# EasyEDA Pro project ProPrj_measure_boardd_2025-03-12.epro

# Schematic Schematic1
Board Name: Board1; Create Date: 2025-02-12; Page Name: P1; Project Name: measure_boardd; Schematic Name: Schematic1; Update Date: 2025-03-10; Company: EasyEDA.com; Page Size: A4; Version: V1.0
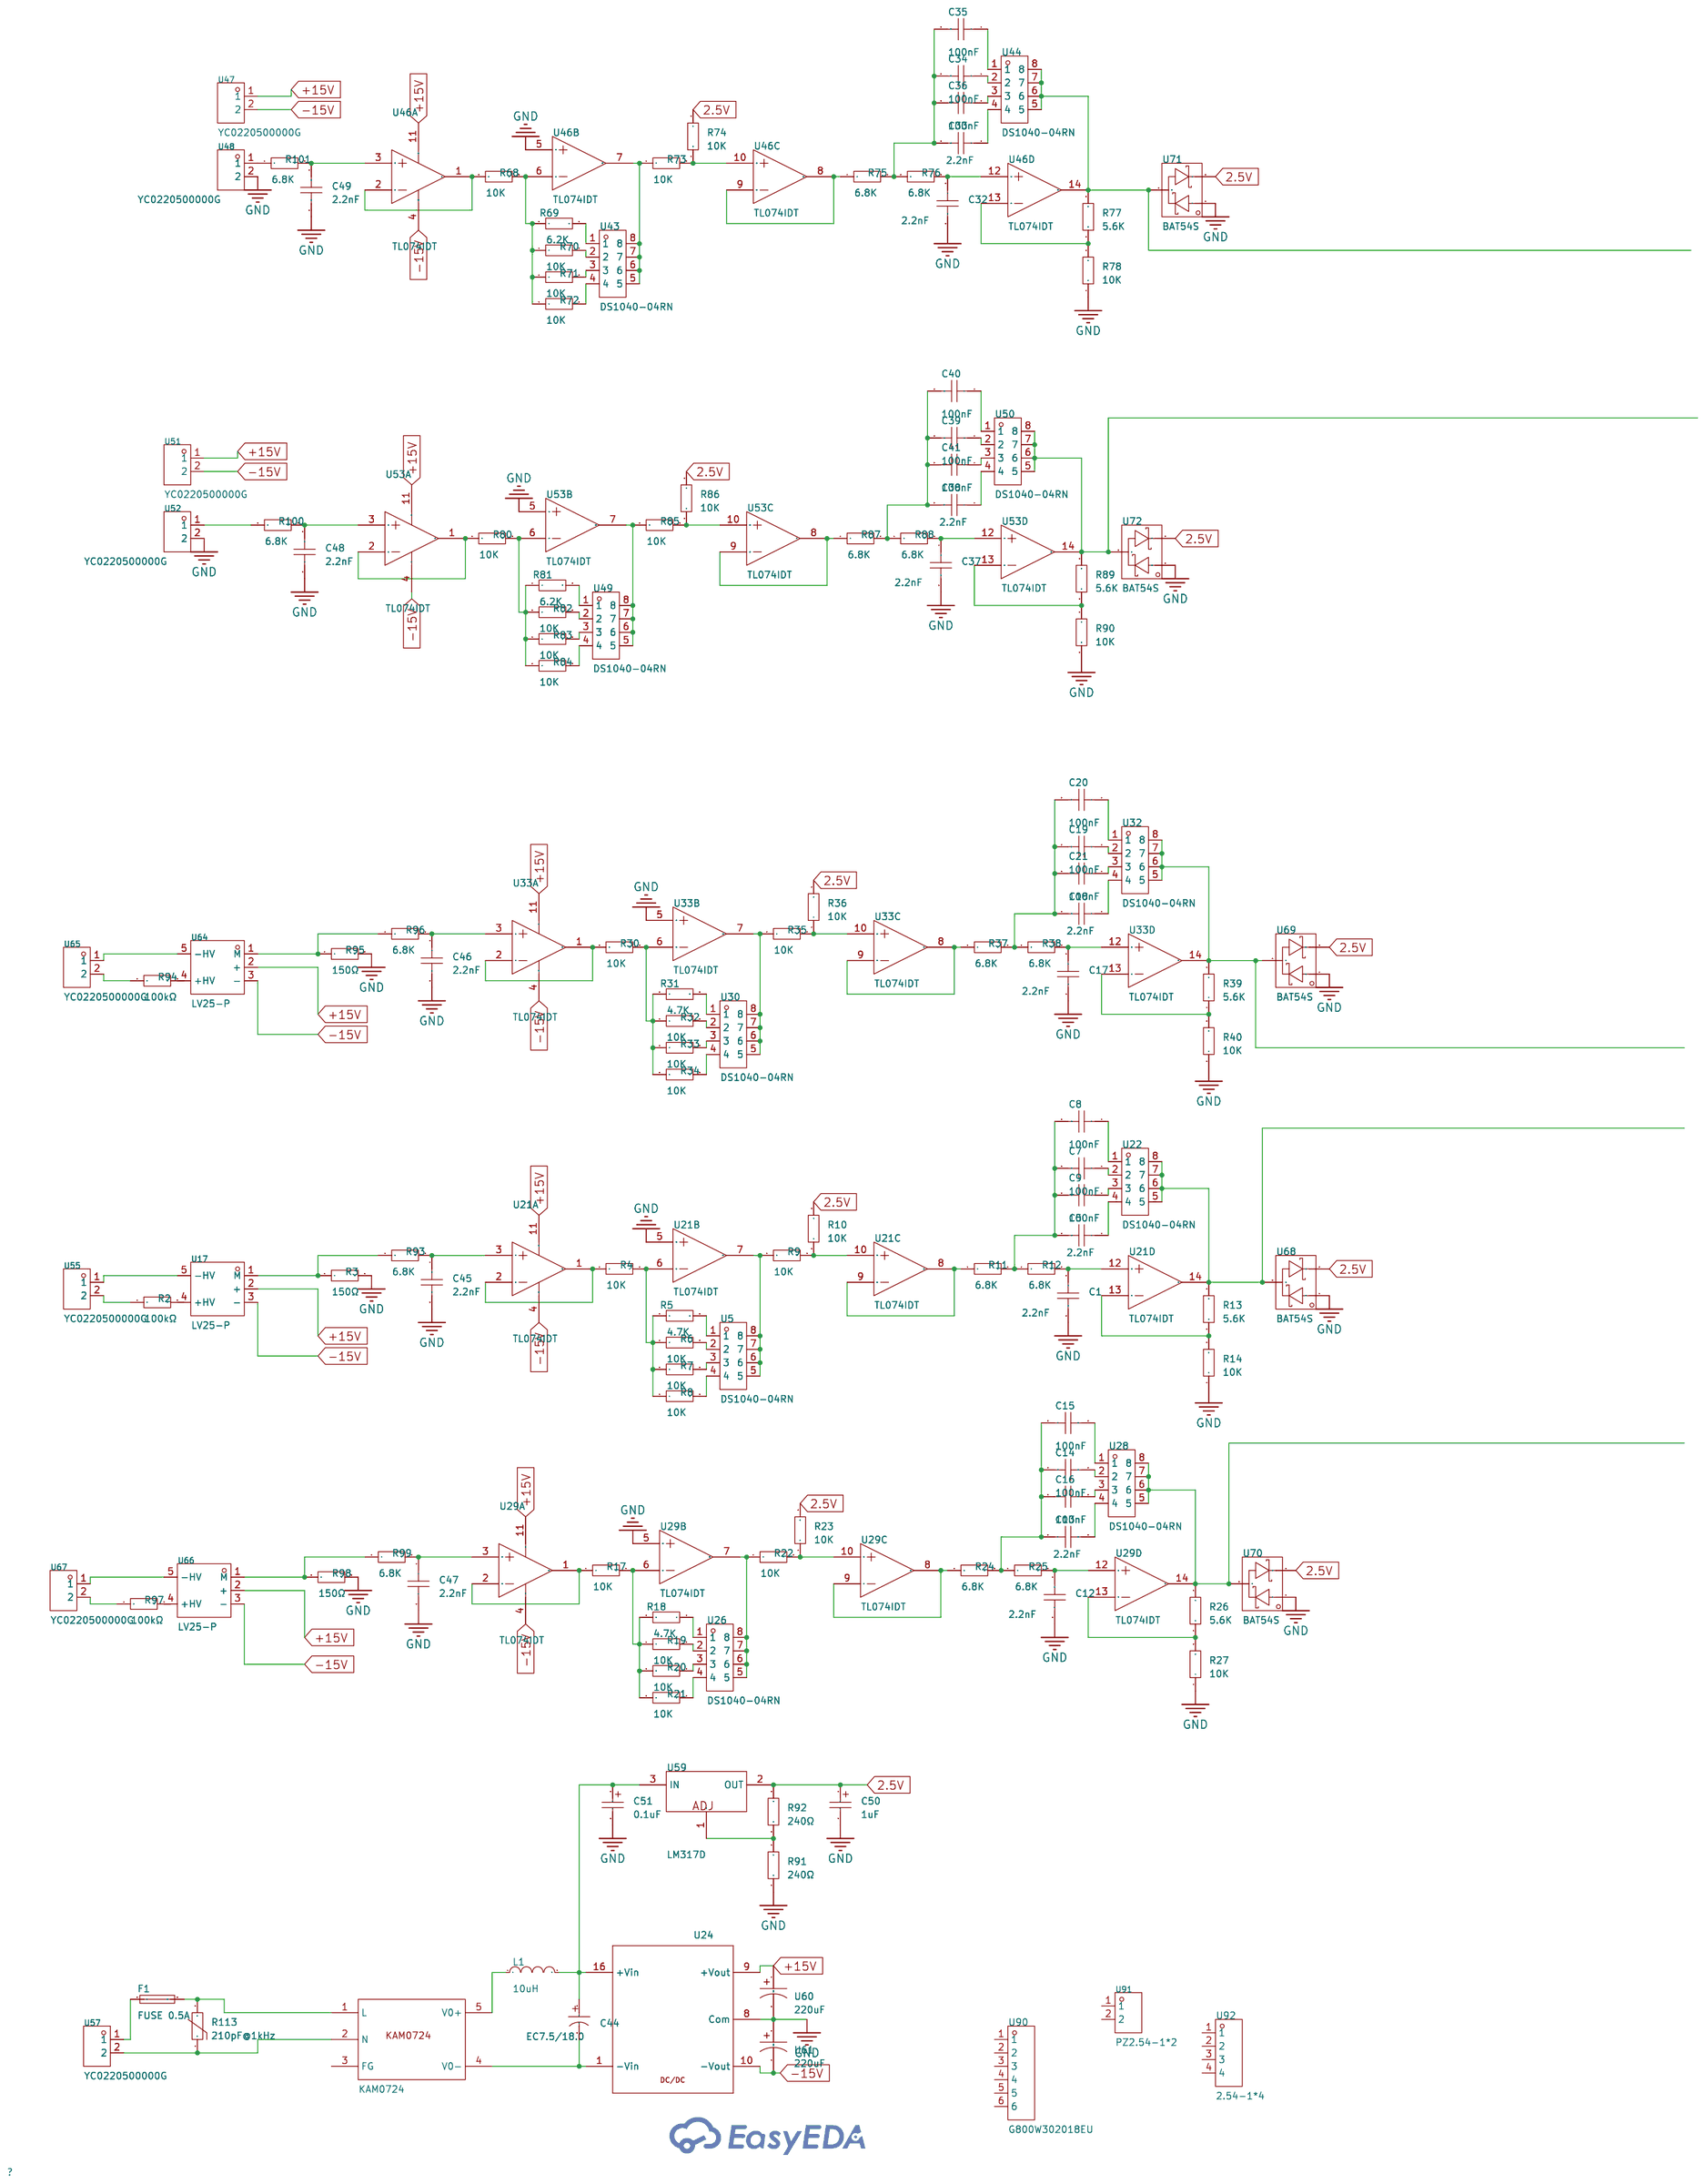
[diagram p0: schematic sheet]

## Parts
C1  2.2nF  [C0805]
C5  2.2nF  [C0805]
C7  100nF  [C0805]
C8  100nF  [C0805]
C9  100nF  [C0805]
C12  2.2nF  [C0805]
C13  2.2nF  [C0805]
C14  100nF  [C0805]
C15  100nF  [C0805]
C16  100nF  [C0805]
C17  2.2nF  [C0805]
C18  2.2nF  [C0805]
C19  100nF  [C0805]
C20  100nF  [C0805]
C21  100nF  [C0805]
C32  2.2nF  [C0805]
C33  2.2nF  [C0805]
C34  100nF  [C0805]
C35  100nF  [C0805]
C36  100nF  [C0805]
C37  2.2nF  [C0805]
C38  2.2nF  [C0805]
C39  100nF  [C0805]
C40  100nF  [C0805]
C41  100nF  [C0805]
C44  EC7.5/18.0  [CAP-TH_BD18.0-P7.50-D1.2-FD]
C45  2.2nF  [C0805]
C46  2.2nF  [C0805]
C47  2.2nF  [C0805]
C48  2.2nF  [C0805]
C49  2.2nF  [C0805]
C50  1uF  [CAP-SMD_BD4.0-L4.3-W4.3-FD]
C51  0.1uF  [CAP-SMD_BD4.0-L4.3-W4.3-FD]
F1  FUSE 0.5A  [FUSE-TH_L8.5-W4.0-P5.08-D0.6]
L1  10uH  [L0805]
R2  100kΩ  [RES-TH_BD8.0-L24.5-P28.50-D0.8]
R3  150Ω  [R_AXIAL-0.4]
R4  10K  [R0603]
R5  4.7K  [R0603]
R6  10K  [R0603]
R7  10K  [R0603]
R8  10K  [R0603]
R9  10K  [R0603]
R10  10K  [R0603]
R11  6.8K  [R0603]
R12  6.8K  [R0603]
R13  5.6K  [R0603]
R14  10K  [R0603]
R17  10K  [R0603]
R18  4.7K  [R0603]
R19  10K  [R0603]
R20  10K  [R0603]
R21  10K  [R0603]
R22  10K  [R0603]
R23  10K  [R0603]
R24  6.8K  [R0603]
R25  6.8K  [R0603]
R26  5.6K  [R0603]
R27  10K  [R0603]
R30  10K  [R0603]
R31  4.7K  [R0603]
R32  10K  [R0603]
R33  10K  [R0603]
R34  10K  [R0603]
R35  10K  [R0603]
R36  10K  [R0603]
R37  6.8K  [R0603]
R38  6.8K  [R0603]
R39  5.6K  [R0603]
R40  10K  [R0603]
R68  10K  [R0603]
R69  6.2K  [R0603]
R70  10K  [R0603]
R71  10K  [R0603]
R72  10K  [R0603]
R73  10K  [R0603]
R74  10K  [R0603]
R75  6.8K  [R0603]
R76  6.8K  [R0603]
R77  5.6K  [R0603]
R78  10K  [R0603]
R80  10K  [R0603]
R81  6.2K  [R0603]
R82  10K  [R0603]
R83  10K  [R0603]
R84  10K  [R0603]
R85  10K  [R0603]
R86  10K  [R0603]
R87  6.8K  [R0603]
R88  6.8K  [R0603]
R89  5.6K  [R0603]
R90  10K  [R0603]
R91  240Ω  [R1210]
R92  240Ω  [R1210]
R93  6.8K  [R0603]
R94  100kΩ  [RES-TH_BD8.0-L24.5-P28.50-D0.8]
R95  150Ω  [R_AXIAL-0.4]
R96  6.8K  [R0603]
R97  100kΩ  [RES-TH_BD8.0-L24.5-P28.50-D0.8]
R98  150Ω  [R_AXIAL-0.4]
R99  6.8K  [R0603]
R100  6.8K  [R0603]
R101  6.8K  [R0603]
R113  210pF@1kHz  [RES-TH_L12.5-W5.1-P7.50-D1.2-S2.20]
U5  DS1040-04RN  [KEY-TH_DS1040-04RN]
U17  LV25-P  [SENSOR-TH_LV25-P]
U21  TL074IDT  [SOIC-14_L8.7-W3.9-P1.27-LS6.0-BL]  (sections 1,2,3,4)
U22  DS1040-04RN  [KEY-TH_DS1040-04RN]
U24  -  [TEL_8_SERIES]
U26  DS1040-04RN  [KEY-TH_DS1040-04RN]
U28  DS1040-04RN  [KEY-TH_DS1040-04RN]
U29  TL074IDT  [SOIC-14_L8.7-W3.9-P1.27-LS6.0-BL]  (sections 1,2,3,4)
U30  DS1040-04RN  [KEY-TH_DS1040-04RN]
U32  DS1040-04RN  [KEY-TH_DS1040-04RN]
U33  TL074IDT  [SOIC-14_L8.7-W3.9-P1.27-LS6.0-BL]  (sections 1,2,3,4)
U43  DS1040-04RN  [KEY-TH_DS1040-04RN]
U44  DS1040-04RN  [KEY-TH_DS1040-04RN]
U46  TL074IDT  [SOIC-14_L8.7-W3.9-P1.27-LS6.0-BL]  (sections 1,2,3,4)
U47  YC0220500000G  [CONN-TH_YC0220500000G]
U48  YC0220500000G  [CONN-TH_YC0220500000G]
U49  DS1040-04RN  [KEY-TH_DS1040-04RN]
U50  DS1040-04RN  [KEY-TH_DS1040-04RN]
U51  YC0220500000G  [CONN-TH_YC0220500000G]
U52  YC0220500000G  [CONN-TH_YC0220500000G]
U53  TL074IDT  [SOIC-14_L8.7-W3.9-P1.27-LS6.0-BL]  (sections 1,2,3,4)
U55  YC0220500000G  [CONN-TH_YC0220500000G]
U57  YC0220500000G  [CONN-TH_YC0220500000G]
U59  LM317D  [TO-252-2_L6.6-W6.1-P4.57-LS9.9-BR-CW]
U60  220uF  [CAP-TH_BD6.3-P2.50-D0.6-FD]
U61  220uF  [CAP-TH_BD6.3-P2.50-D0.6-FD]
U62  KAM0724  [KAM0724]
U64  LV25-P  [SENSOR-TH_LV25-P]
U65  YC0220500000G  [CONN-TH_YC0220500000G]
U66  LV25-P  [SENSOR-TH_LV25-P]
U67  YC0220500000G  [CONN-TH_YC0220500000G]
U68  BAT54S  [SOT-23-3_L2.9-W1.3-P1.90-LS2.4-BR]
U69  BAT54S  [SOT-23-3_L2.9-W1.3-P1.90-LS2.4-BR]
U70  BAT54S  [SOT-23-3_L2.9-W1.3-P1.90-LS2.4-BR]
U71  BAT54S  [SOT-23-3_L2.9-W1.3-P1.90-LS2.4-BR]
U72  BAT54S  [SOT-23-3_L2.9-W1.3-P1.90-LS2.4-BR]
U90  G800W302018EU  [HDR-TH_6P-P2.54-V-M]
U91  PZ2.54-1*2  [HDR-TH_2P-P2.54-V-M-3]
U92  2.54-1*4  [HDR-TH_4P-P2.54-V-M-1]

## Library data of the parts
C1 C5 C7-C9 C12-C21 C32-C41 C45-C49 = CAP_0805: Supplier Footprint: 0805
C44 = EC7.5/18.0: Supplier Part: C9900017020; Supplier Footprint: 1000uF/63V；间距7.5mm外径18mm; JLCPCB Part Class: Extended Part; Supplier: LCSC
C50 C51 = C_Ele_SMD_4x5.5mm: Supplier Footprint: SMD,4x5.5mm
F1 = FUSE 0.5A: Supplier: LCSC; Supplier Part: C312031; Manufacturer: TLC(竞沃); Manufacturer Part: SQT3.15M; JLCPCB Part Class: Extended Part
L1 = L_0805
R2 R94 R97 = Res_AXIAL-5W: Supplier Footprint: Through
R3 R95 R98 = Res_AXIAL-1/4W: Supplier Footprint: Through
R4-R14 R17-R27 R30-R40 R68-R78 R80-R90 R93 R96 R99-R101 = Res_0603: Supplier Footprint: 0603
R91 R92 = Res_1210: Supplier Footprint: 1210
R113 = VDR-10D471K: Varistor Voltage:423V~517V Varistor Voltage:423V~517V Clamping Voltage: Maximum DC Volts: Maximum AC Volts: Peak Current: Energy:67J Energy:67J Capacitance:210pF@1kHz; LCSC Part Name: 钳位电压775V 67焦耳 插件压敏电阻; Supplier Part: C316609; Manufacturer: VDR(嵩隆); Supplier Footprint: 插件; JLCPCB Part Class: Extended Part; Datasheet: https://atta.szlcsc.com/upload/public/pdf/source/20210908/63B170955D01000DCFD7BF012F3B4797.pdf; Supplier: LCSC; Varistor Voltage: 423V~517V; Energy: 67J
U5 U22 U26 U28 U30 U32 U43 U44 U49 U50 = DS1040-04RN: Number of Positions:4Bit Lead Pitch:2.54mm Color:Red; Supplier Part: C3024970; Manufacturer: CONNFLY; Supplier Footprint: 插件; JLCPCB Part Class: Extended Part; Datasheet: https://atta.szlcsc.com/upload/public/pdf/source/20220524/E487E22DEF95345BB2C3C9897C5E0C2D.pdf; Supplier: LCSC; Number of Positions: 4Bit; Lead Pitch: 2.54mm; Color: Red
U17 U64 U66 = LV25-P: Supplier Part: C453476; Manufacturer: LEM(莱姆); Supplier Footprint: 插件; JLCPCB Part Class: Extended Part; Datasheet: https://atta.szlcsc.com/upload/public/pdf/source/20200901/C453476_5BA3BC4F59636857A644FEC5A2FF2FFA.pdf; Supplier: LCSC
U21 U29 U33 U46 U53 = TL074IDT: Number of Circuits:Quad Gain Bandwidth Product(GBP):3MHz Current - Input Bias(Ib):20pA Voltage - Input Offset(Vos):3mV Slew Rate(SR):13V/us Supply Current Per Channel:1.4mA Operating Temperature:-40℃~+105℃ Operating Temperature:-40℃~+105℃; Supplier Part: C107644; Manufacturer: ST(意法半导体); Supplier Footprint: SOIC-14; JLCPCB Part Class: Extended Part; Datasheet: https://atta.szlcsc.com/upload/public/pdf/source/20180511/C79668_B9AF02D8BC6CC04960E26C1CA949D7C5.pdf; Supplier: LCSC; Number of Circuits: Quad; Gain Bandwidth Product(GBP): 3MHz; Current - Input Bias(Ib): 20pA; Voltage - Input Offset(Vos): 3mV; Slew Rate(SR): 13V/us; Supply Current Per Channel: 1.4mA; Operating Temperature: -40℃~+105℃
U24 = TEL_8-2423
U47 U48 U51 U52 U55 U57 U65 U67 = YC0220500000G: Structure:1x2P Pitch:5.08mm Color:Green Mounting Style:Straight Current Rating (Max):10A Voltage Rating (Max):300V Number of Pins:2P Number of Rows:1 Wire Gauge - AWG:16~26 Wire Gauge - AWG:16~26 Number of PINs Per Row:2 Operating Temperature Range:-40℃~+; LCSC Part Name: 5.08mm 1x2P 排数:1 每排P数:2 直插; Supplier Part: C2683165; Manufacturer: Amphenol; Supplier Footprint: 插件,P=5.08mm; JLCPCB Part Class: Extended Part; Datasheet: https://atta.szlcsc.com/upload/public/pdf/source/20210329/C2683165_184F37C3428385EA6CBC65FCC2B0FE9A.pdf; Supplier: LCSC; Structure: 1x2P; Pitch: 5.08mm; Color: Green; Mounting Style: Straight; Current Rating (Max): 10A; Voltage Rating (Max): 300V; Number of Pins: 2P; Number of Rows: 1; Wire Gauge - AWG: 16~26; Number of PINs Per Row: 2; Operating Temperature Range: -40℃~+115℃
U59 = LM317D: Output Type:Adjustable Maximum Input Voltage:- Output Voltage:1.2V~37V Output Voltage:1.2V~37V Output Current:1.5A Power Supply Rejection Ratio (PSRR):80dB@(120Hz) Operating Temperature:0℃~+125℃@(Tj) Operating Temperature:0℃~+125℃@(Tj) Output Polarity:Pos; Supplier Part: C19273122; Manufacturer: YFW(佑风微); Supplier Footprint: TO-252; JLCPCB Part Class: Extended Part; Datasheet: https://atta.szlcsc.com/upload/public/pdf/source/20231201/418A6F2C5017D5AE5FD34272C42A6510.pdf; Supplier: LCSC; Output Type: Adjustable; Output Voltage: 1.2V~37V; Output Current: 1.5A; Power Supply Rejection Ratio (PSRR): 80dB@(120Hz); Operating Temperature: 0℃~+125℃@(Tj); Output Polarity: Positive electrode; Number of Outputs: 1
U60 U61 = 25V220uF CD288: Capacitance: Tolerance:±20% Tolerance:±20% Rated Voltage: Lead Spacing: φD: L: Operating Temperature:-40℃~+105℃ Operating Temperature:-40℃~+105℃; LCSC Part Name: 220uF ±20% 25V; Supplier Part: C2960221; Manufacturer: HRK(鸿瑞凯电子); Supplier Footprint: 插件,D6.3xL12mm; JLCPCB Part Class: Extended Part; Datasheet: https://atta.szlcsc.com/upload/public/pdf/source/20220224/4E62C25599E7046827B6B2B120EB46F9.pdf; Supplier: LCSC; Tolerance: ±20%; Operating Temperature: -40℃~+105℃
U62 = KAM0724
U68-U72 = BAT54S_C22374724: Supplier Part: C22374724; Manufacturer: DOWO(东沃); Supplier Footprint: SOT-23; JLCPCB Part Class: Extended Part; Datasheet: https://atta.szlcsc.com/upload/public/pdf/source/20240402/00E7935314739AA8A2B57AD1567A1D2C.pdf; Supplier: LCSC
U90 = G800W302018EU: Pin Structure:1x6P Pitch:2.54mm Number of Rows:Single Row Number of Pins:6P; LCSC Part Name: 1x6P 间距:2.54mm; Supplier Part: C5427040; Manufacturer: Amphenol; Supplier Footprint: 插件,P=2.54mm; JLCPCB Part Class: Extended Part; Supplier: LCSC; Pin Structure: 1x6P; Pitch: 2.54mm; Number of Rows: Single Row; Number of Pins: 6P
U91 = PZ2.54-1*2: Supplier Part: C5360898; Manufacturer: ZHOURI(洲日); Supplier Footprint: 插件,P=2.54mm; JLCPCB Part Class: Extended Part; Datasheet: https://atta.szlcsc.com/upload/public/pdf/source/20220323/224B1BE3995440B78463F26874D564A6.pdf; Supplier: LCSC
U92 = 2.54-1*4: Pin Structure:1x4P Pitch:2.54mm Number of Rows:Plugin Number of Pins:4P; Supplier Part: C5116483; Manufacturer: ZHOURI(洲日); Supplier Footprint: 插件,P=2.54mm; JLCPCB Part Class: Extended Part; Datasheet: https://atta.szlcsc.com/upload/public/pdf/source/20220729/BC3442D33C9CDBB7F5DC20B12A8605A8.pdf; Supplier: LCSC; Pin Structure: 1x4P; Pitch: 2.54mm; Number of Rows: Plugin; Number of Pins: 4P

## Nets
2.5V: C50.1 R10.2 R23.2 R36.2 R74.2 R86.2 R92.2 U59.2(OUT) U68.2 U69.2 U70.2 U71.2 U72.2
+15V: U17.2(+) U21.11(VCC-) U24.9(+Vout) U29.11(VCC-) U33.11(VCC-) U46.11(VCC-) U47.1 U51.1 U53.11(VCC-) U60.1 U64.2(+) U66.2(+)
-15V: U17.3(-) U21.4(VCC+) U24.10(-Vout) U29.4(VCC+) U33.4(VCC+) U46.4(VCC+) U47.2 U51.2 U53.4(VCC+) U61.2 U64.3(-) U66.3(-)
GND: C1.2 C12.2 C17.2 C32.2 C37.2 C45.2 C46.2 C47.2 C48.2 C49.2 C50.2 C51.2 R3.2 R14.1 R27.1 R40.1 R78.1 R90.1 R91.1 R95.2 R98.2 U21.5(2IN+) U24.8(Com) U29.5(2IN+) U33.5(2IN+) U46.5(2IN+) U48.2 U52.2 U53.5(2IN+) U60.2 U61.1 U68.1 U69.1 U70.1 U71.1 U72.1
$1N1565: R2.2 U17.4(+HV)
$1N1815: R3.1 R93.1 U17.1(M)
$1N1976: R4.1 U21.1(1OUT) U21.2(1IN-)
$1N2054: R5.2 U5.1
$1N2080: R6.2 U5.2
$1N2106: R7.2 U5.3
$1N2182: R8.2 U5.4
$1N2231: R9.1 U5.5 U5.6 U5.7 U5.8 U21.7(2OUT)
$1N2551: R11.1 U21.8(3OUT) U21.9(3IN-)
$1N2651: R9.2 R10.1 U21.10(3IN+)
$1N3069: C5.2 C7.2 C8.2 C9.2 R11.2 R12.1
$1N3119: C1.1 R12.2 U21.12(4IN+)
$1N3183: R13.1 R14.2 U21.13(4IN-)
$1N3559: R4.2 R5.1 R6.1 R7.1 R8.1 U21.6(2IN-)
$1N4470: C5.1 U22.4
$1N4558: C7.1 U22.2
$1N4584: C8.1 U22.1
$1N4643: C9.1 U22.3
$1N5599: F1.1 U57.1
$1N5603: R113.1 U57.2 U62.2(N)
$1N6524: R17.2 R18.1 R19.1 R20.1 R21.1 U29.6(2IN-)
$1N6525: R18.2 U26.1
$1N6527: R22.1 U26.5 U26.6 U26.7 U26.8 U29.7(2OUT)
$1N6528: R20.2 U26.3
$1N6529: R19.2 U26.2
$1N6533: R21.2 U26.4
$1N6536: R17.1 U29.1(1OUT) U29.2(1IN-)
$1N6537: R24.1 U29.8(3OUT) U29.9(3IN-)
$1N6538: R22.2 R23.1 U29.10(3IN+)
$1N6548: R26.1 R27.2 U29.13(4IN-)
$1N6549: C13.1 U28.4
$1N6551: C16.1 U28.3
$1N6553: C13.2 C14.2 C15.2 C16.2 R24.2 R25.1
$1N6559: C12.1 R25.2 U29.12(4IN+)
$1N6560: C14.1 U28.2
$1N6568: C15.1 U28.1
$1N7416: R30.2 R31.1 R32.1 R33.1 R34.1 U33.6(2IN-)
$1N7417: R31.2 U30.1
$1N7419: R35.1 U30.5 U30.6 U30.7 U30.8 U33.7(2OUT)
$1N7420: R33.2 U30.3
$1N7421: R32.2 U30.2
$1N7425: R34.2 U30.4
$1N7428: R30.1 U33.1(1OUT) U33.2(1IN-)
$1N7429: R37.1 U33.8(3OUT) U33.9(3IN-)
$1N7430: R35.2 R36.1 U33.10(3IN+)
$1N7440: R39.1 R40.2 U33.13(4IN-)
$1N7441: C18.1 U32.4
$1N7443: C21.1 U32.3
$1N7445: C18.2 C19.2 C20.2 C21.2 R37.2 R38.1
$1N7451: C17.1 R38.2 U33.12(4IN+)
$1N7452: C19.1 U32.2
$1N7460: C20.1 U32.1
$1N10154: R72.2 U43.4
$1N10155: R68.2 R69.1 R70.1 R71.1 R72.1 U46.6(2IN-)
$1N10156: R73.1 U43.5 U43.6 U43.7 U43.8 U46.7(2OUT)
$1N10157: R71.2 U43.3
$1N10158: R70.2 U43.2
$1N10165: C36.1 U44.3
$1N10167: C33.2 C34.2 C35.2 C36.2 R75.2 R76.1
$1N10173: C35.1 U44.1
$1N10175: C34.1 U44.2
$1N10180: R69.2 U43.1
$1N10182: R68.1 U46.1(1OUT) U46.2(1IN-)
$1N10186: R77.1 R78.2 U46.13(4IN-)
$1N10196: C33.1 U44.4
$1N10198: C32.1 R76.2 U46.12(4IN+)
$1N10199: R73.2 R74.1 U46.10(3IN+)
$1N10200: R75.1 U46.8(3OUT) U46.9(3IN-)
$1N14932: U17.5(-HV) U55.1
$1N17336: F1.2 R113.2 U62.1(L)
$1N20202: R80.1 U53.1(1OUT) U53.2(1IN-)
$1N20203: R81.2 U49.1
$1N20204: R82.2 U49.2
$1N20205: R83.2 U49.3
$1N20206: R84.2 U49.4
$1N20207: R85.1 U49.5 U49.6 U49.7 U49.8 U53.7(2OUT)
$1N20208: R87.1 U53.8(3OUT) U53.9(3IN-)
$1N20209: R85.2 R86.1 U53.10(3IN+)
$1N20211: C38.2 C39.2 C40.2 C41.2 R87.2 R88.1
$1N20212: C37.1 R88.2 U53.12(4IN+)
$1N20213: R89.1 R90.2 U53.13(4IN-)
$1N20216: R80.2 R81.1 R82.1 R83.1 R84.1 U53.6(2IN-)
$1N20218: C38.1 U50.4
$1N20221: C41.1 U50.3
$1N20222: C40.1 U50.1
$1N20223: C39.1 U50.2
$1N20370: R2.1 U55.2
$1N20734: R91.2 R92.1 U59.1(ADJ)
$1N23806: C44.2 U24.1(-Vin) U62.4(V0-)
$1N36258: L1.1 U62.5(V0+)
$1N41392: C45.1 R93.2 U21.3(1IN+)
$1N41681: C46.1 R96.2 U33.3(1IN+)
$1N41683: R94.2 U64.4(+HV)
$1N41685: R95.1 R96.1 U64.1(M)
$1N41691: U64.5(-HV) U65.1
$1N41692: R94.1 U65.2
$1N42087: R98.1 R99.1 U66.1(M)
$1N42093: R97.2 U66.4(+HV)
$1N42096: R97.1 U67.2
$1N42097: U66.5(-HV) U67.1
$1N42100: C47.1 R99.2 U29.3(1IN+)
$1N42167: C48.1 R100.2 U53.3(1IN+)
$1N42170: R100.1 U52.1
$1N42233: C49.1 R101.2 U46.3(1IN+)
$1N42236: R101.1 U48.1
Net-(C44-1): C44.1 C51.1 L1.2 U24.16(+Vin) U59.3(IN)
Net-(R13-2): R13.2 U21.14(4OUT) U22.5 U22.6 U22.7 U22.8 U68.3
Net-(R26-2): R26.2 U28.5 U28.6 U28.7 U28.8 U29.14(4OUT) U70.3
Net-(R39-2): R39.2 U32.5 U32.6 U32.7 U32.8 U33.14(4OUT) U69.3
Net-(R77-2): R77.2 U44.5 U44.6 U44.7 U44.8 U46.14(4OUT) U71.3
Net-(R89-2): R89.2 U50.5 U50.6 U50.7 U50.8 U53.14(4OUT) U72.3

Not connected (* = marked no-connect by the designer): U62 3(FG); U90 1 2 3 4 5 6; U91 1 2; U92 1 2 3 4

# Board PCB1
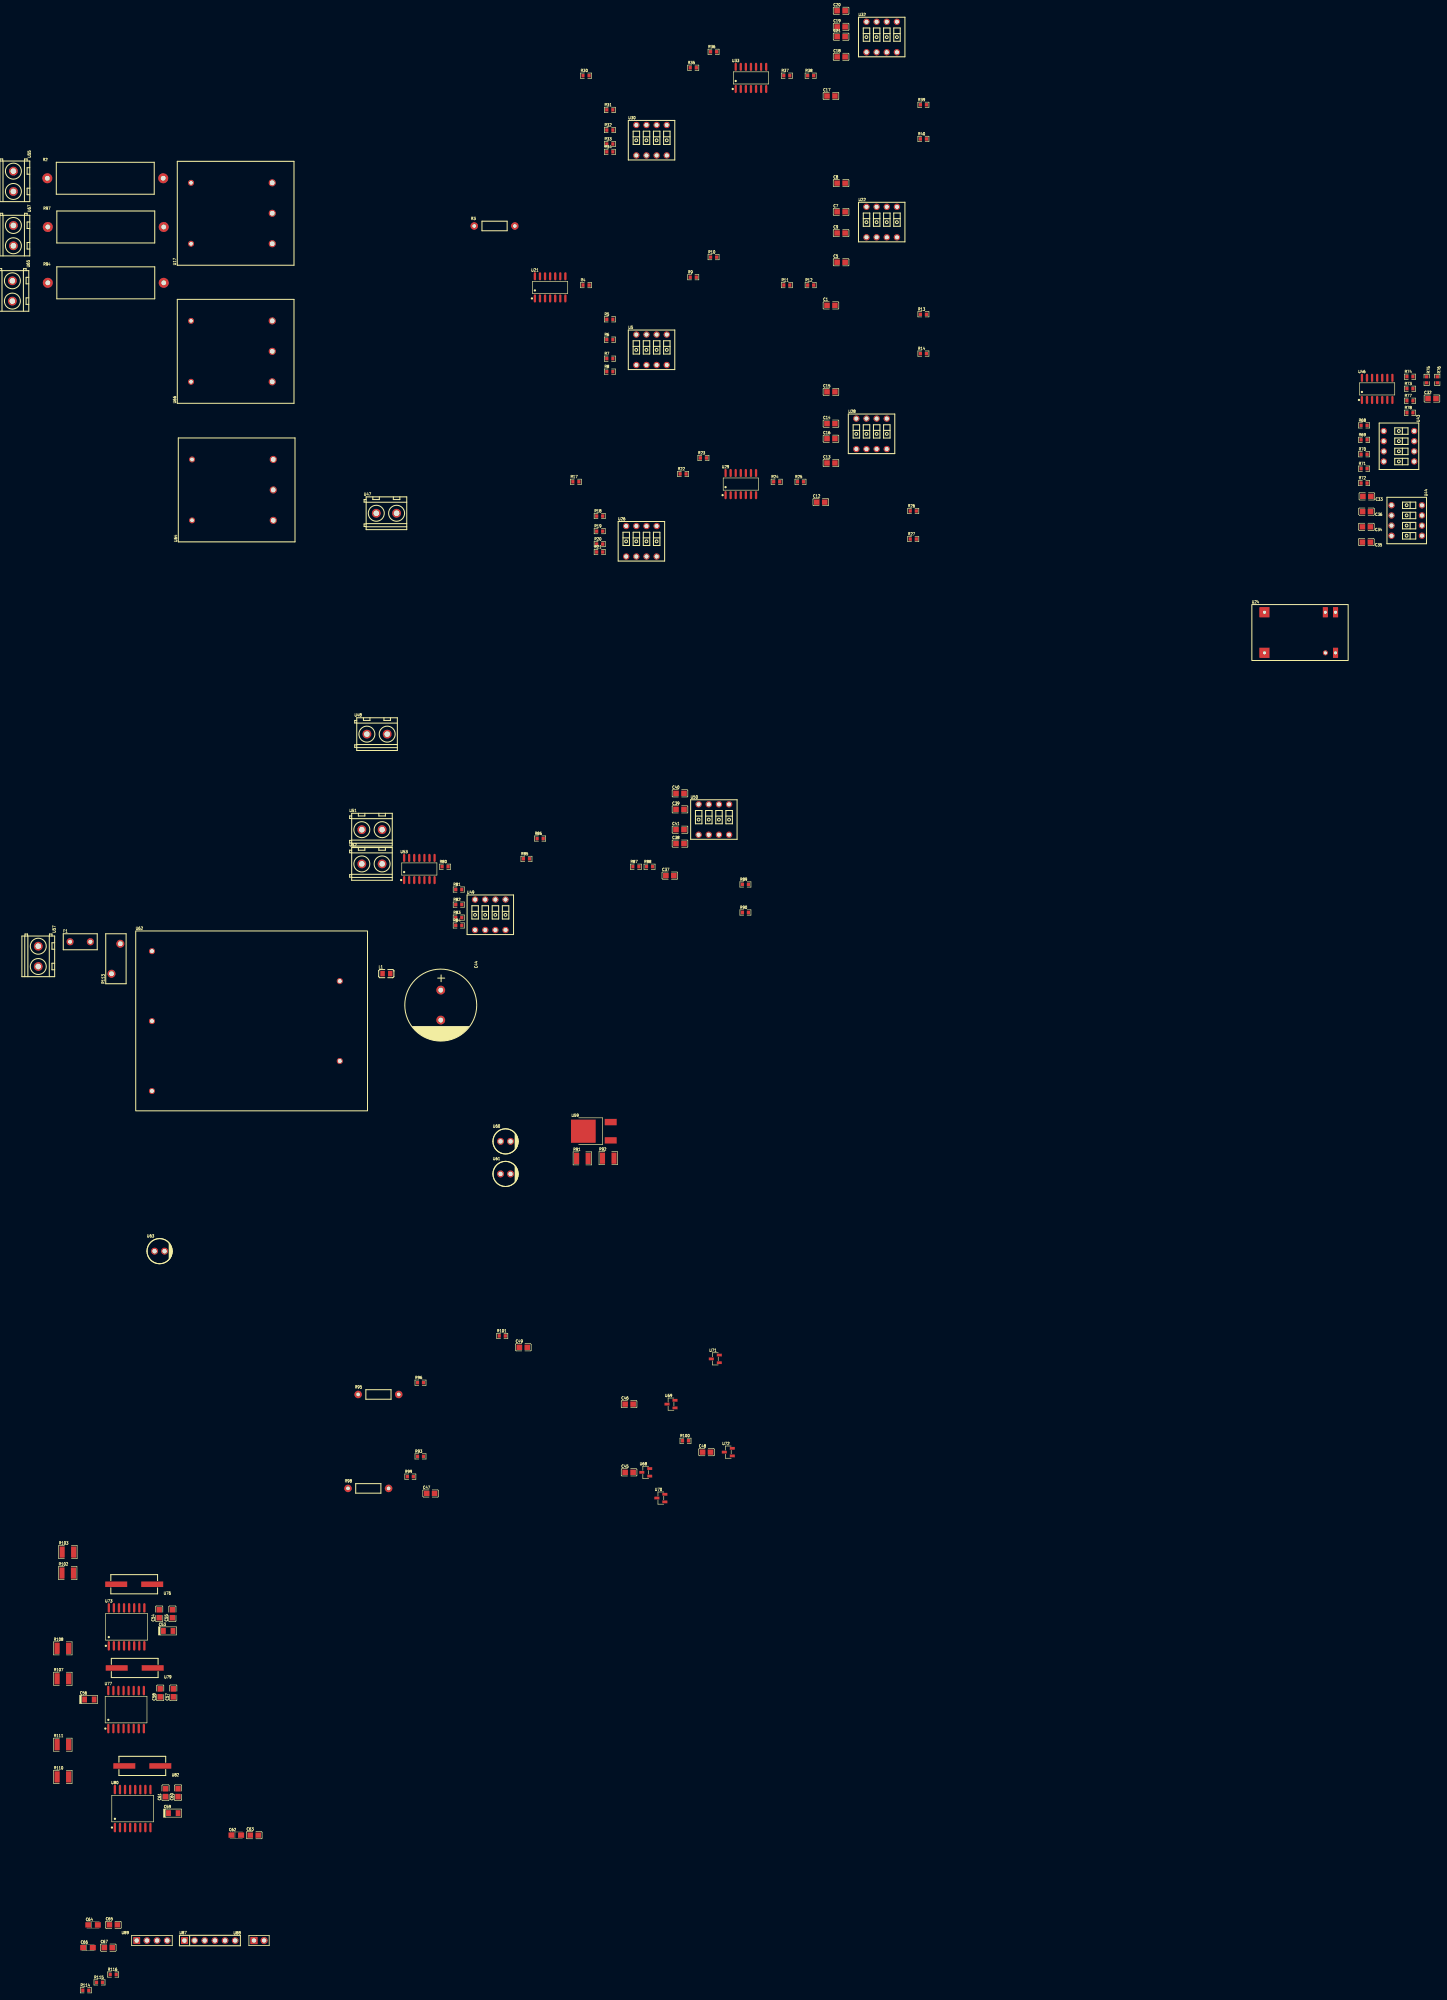
[diagram p1: board, top side]
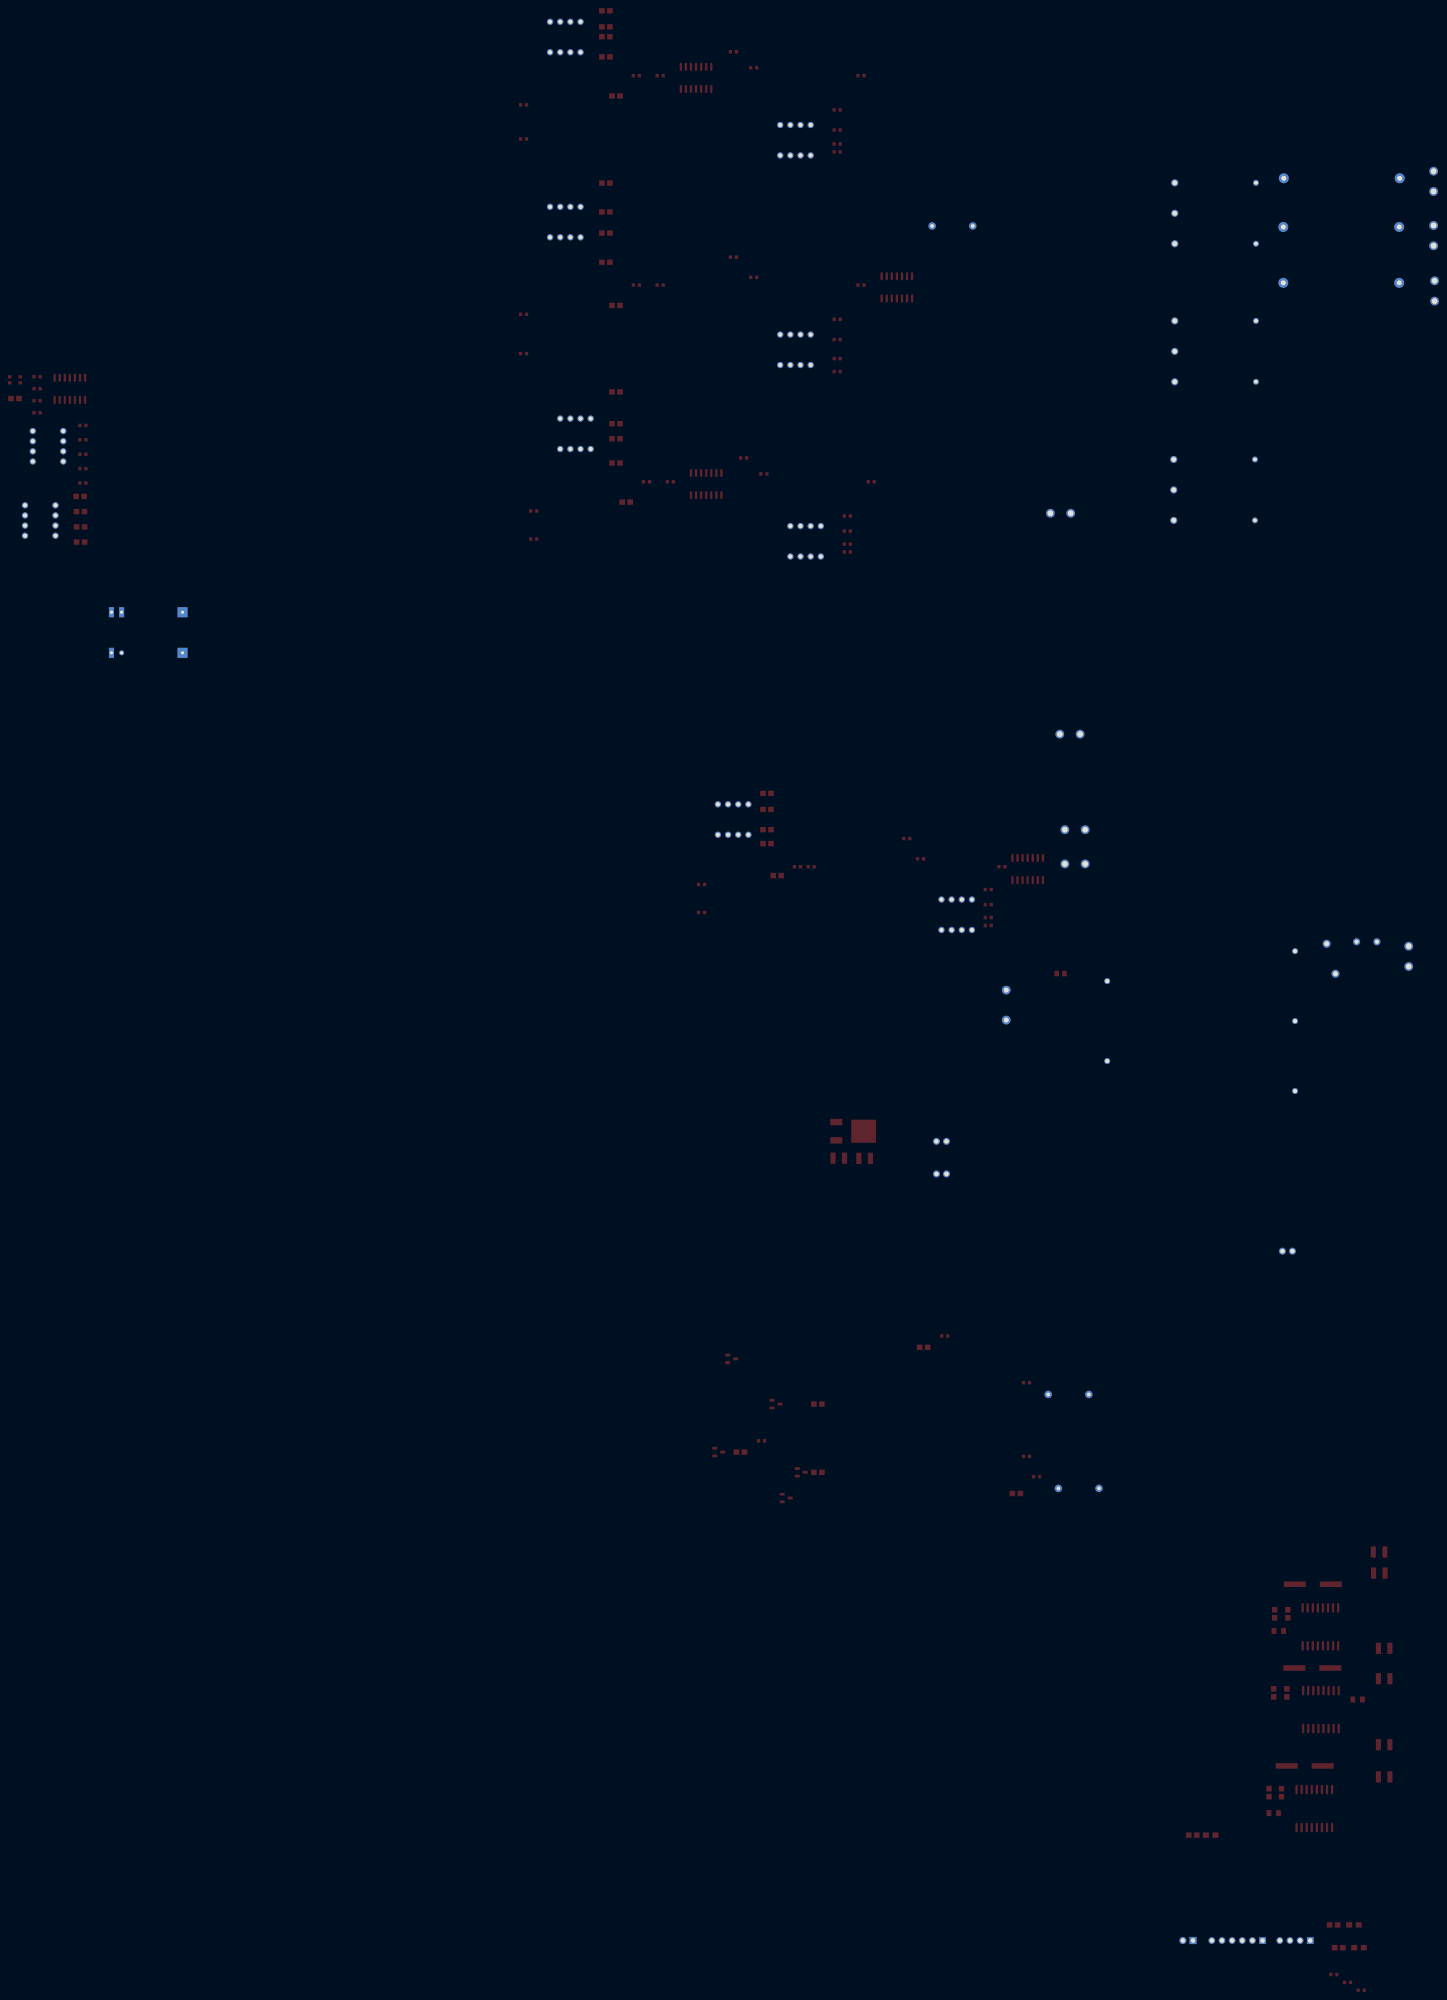
[diagram p2: board, bottom side, seen from below]

No outline. copper layers: Top Layer, Bottom Layer. Coordinates in mm from the lowest, leftmost part position.
Stack: Top Layer 0.035mm / Dielectric1 1.51mm FR4 er 4.5 / Bottom Layer 0.035mm

## Design rules (mm)
template: JLCPCB Capability(Two Layers Board)
spacing copperThickness1oz (default): track to track 0.102, other pairs 0.152 to 0.3
spacing copperThickness2oz: track to track 0.203, other pairs 0.152 to 0.3
track width copperThickness1oz (default): min 0.127, default 0.254, max 2.54
track width copperThickness2oz: min 0.203, default 0.254, max 2.54
differential pair differentialPair (default): width min 0.127, default 0.254, max 2.54; gap min 0.152, default 0.152
via viaSize (default): diameter min 0.5, default 0.61, max 10; hole min 0.3, default 0.305, max 6.3

## Placement (name value [footprint] x y rotation side)
C1  2.2nF  [C0805]  204.83 421.58 0 top
C5  2.2nF  [C0805]  207.37 432.39 0 top
C7  100nF  [C0805]  207.37 444.97 0 top
C8  100nF  [C0805]  207.37 452.19 0 top
C9  100nF  [C0805]  207.37 439.69 0 top
C12  2.2nF  [C0805]  202.29 372.36 0 top
C13  2.2nF  [C0805]  204.83 382.14 0 top
C14  100nF  [C0805]  204.83 391.99 0 top
C15  100nF  [C0805]  204.83 399.93 0 top
C16  100nF  [C0805]  204.83 388.22 0 top
C17  2.2nF  [C0805]  204.83 473.99 0 top
C18  2.2nF  [C0805]  207.37 483.77 0 top
C19  100nF  [C0805]  207.37 491.27 0 top
C20  100nF  [C0805]  207.37 495.29 0 top
C21  100nF  [C0805]  207.37 488.81 0 top
C32  2.2nF  [C0805]  355.22 398.27 0 top
C33  2.2nF  [C0805]  338.94 373.79 180 top
C34  100nF  [C0805]  338.81 366.17 180 top
C35  100nF  [C0805]  338.81 362.36 180 top
C36  100nF  [C0805]  338.85 369.98 180 top
C37  2.2nF  [C0805]  164.51 278.91 0 top
C38  2.2nF  [C0805]  167.05 286.91 0 top
C39  100nF  [C0805]  167.05 295.48 0 top
C40  100nF  [C0805]  167.05 299.49 0 top
C41  100nF  [C0805]  167.05 290.4 0 top
C44  EC7.5/18.0  [CAP-TH_BD18.0-P7.50-D1.2-FD]  107.19 246.51 270 top
C45  2.2nF  [C0805]  154.32 129.6 0 top
C46  2.2nF  [C0805]  154.32 146.67 0 top
C47  2.2nF  [C0805]  104.66 124.31 0 top
C48  2.2nF  [C0805]  173.7 134.65 0 top
C49  2.2nF  [C0805]  127.85 160.89 0 top
C53  1uF  [CAP-SMD_L3.2-W1.6-FD]  38.99 89.92 0 top
C54  33pF  [C0805]  36.73 94.2 90 top
C55  33pF  [C0805]  40.03 94.2 90 top
C56  1uF  [CAP-SMD_L3.2-W1.6-FD]  19.27 72.76 0 top
C57  33pF  [C0805]  40.26 74.42 90 top
C58  33pF  [C0805]  36.98 74.42 90 top
C59  1uF  [CAP-SMD_L3.2-W1.6-FD]  40.26 44.32 0 top
C60  33pF  [C0805]  41.44 49.44 90 top
C61  33pF  [C0805]  38.32 49.44 90 top
C62  1uF  [CASE-A_3216]  56.03 38.81 0 top
C63  0.1uF  [C0805]  60.52 38.81 0 top
C64  1uF  [CASE-A_3216]  20.19 16.36 0 top
C65  0.1uF  [C0805]  25.27 16.36 0 top
C66  1uF  [CASE-A_3216]  18.92 10.66 0 top
C67  0.1uF  [C0805]  24 10.66 0 top
F1  FUSE 0.5A  [FUSE-TH_L8.5-W4.0-P5.08-D0.6]  16.98 262.35 0 top
L1  10uH  [L0805]  93.6 254.38 0 top
R2  100kΩ  [RES-TH_BD8.0-L24.5-P28.50-D0.8]  23.24 453.39 0 top
R3  150Ω  [R_AXIAL-0.4]  120.65 441.45 0 top
R4  10K  [R0603]  143.54 426.66 0 top
R5  4.7K  [R0603]  149.5 418.09 0 top
R6  10K  [R0603]  149.5 413.01 0 top
R7  10K  [R0603]  149.5 408.26 0 top
R8  10K  [R0603]  149.5 405.01 0 top
R9  10K  [R0603]  170.38 428.63 0 top
R10  10K  [R0603]  175.46 433.66 0 top
R11  6.8K  [R0603]  193.78 426.66 0 top
R12  6.8K  [R0603]  199.75 426.66 0 top
R13  5.6K  [R0603]  227.97 419.36 0 top
R14  10K  [R0603]  227.97 409.53 0 top
R17  10K  [R0603]  141 377.44 0 top
R18  4.7K  [R0603]  146.96 368.87 0 top
R19  10K  [R0603]  146.96 365.1 0 top
R20  10K  [R0603]  146.96 361.86 0 top
R21  10K  [R0603]  146.96 359.88 0 top
R22  10K  [R0603]  167.84 379.41 0 top
R23  10K  [R0603]  172.92 383.41 0 top
R24  6.8K  [R0603]  191.25 377.44 0 top
R25  6.8K  [R0603]  197.21 377.44 0 top
R26  5.6K  [R0603]  225.43 370.14 0 top
R27  10K  [R0603]  225.43 363.13 0 top
R30  10K  [R0603]  143.54 479.07 0 top
R31  4.7K  [R0603]  149.5 470.5 0 top
R32  10K  [R0603]  149.5 465.46 0 top
R33  10K  [R0603]  149.5 461.97 0 top
R34  10K  [R0603]  149.5 460 0 top
R35  10K  [R0603]  170.38 481.04 0 top
R36  10K  [R0603]  175.46 485.04 0 top
R37  6.8K  [R0603]  193.78 479.07 0 top
R38  6.8K  [R0603]  199.75 479.07 0 top
R39  5.6K  [R0603]  227.97 471.77 0 top
R40  10K  [R0603]  227.97 463.24 0 top
R68  10K  [R0603]  338.23 391.55 0 top
R69  6.2K  [R0603]  338.23 387.95 0 top
R70  10K  [R0603]  338.23 384.34 0 top
R71  10K  [R0603]  338.23 380.73 0 top
R72  10K  [R0603]  338.23 377.13 0 top
R73  10K  [R0603]  349.71 400.73 0 top
R74  10K  [R0603]  349.71 403.74 0 top
R75  6.8K  [R0603]  353.89 402.96 270 top
R76  6.8K  [R0603]  356.55 402.96 270 top
R77  5.6K  [R0603]  349.71 397.72 0 top
R78  10K  [R0603]  349.71 394.72 0 top
R80  10K  [R0603]  108.27 281.13 0 top
R81  6.2K  [R0603]  111.69 275.42 0 top
R82  10K  [R0603]  111.69 271.65 0 top
R83  10K  [R0603]  111.69 268.41 0 top
R84  10K  [R0603]  111.69 266.43 0 top
R85  10K  [R0603]  128.64 283.1 0 top
R86  10K  [R0603]  132.06 288.18 0 top
R87  6.8K  [R0603]  156.01 281.13 0 top
R88  6.8K  [R0603]  159.43 281.13 0 top
R89  5.6K  [R0603]  183.43 276.69 0 top
R90  10K  [R0603]  183.43 269.68 0 top
R91  240Ω  [R1210]  142.62 208.16 0 top
R92  240Ω  [R1210]  149.1 208.2 0 top
R93  6.8K  [R0603]  102.12 133.58 0 top
R94  100kΩ  [RES-TH_BD8.0-L24.5-P28.50-D0.8]  23.37 427.23 0 top
R95  150Ω  [R_AXIAL-0.4]  91.6 149.08 0 top
R96  6.8K  [R0603]  102.12 152.03 0 top
R97  100kΩ  [RES-TH_BD8.0-L24.5-P28.50-D0.8]  23.37 441.2 0 top
R98  150Ω  [R_AXIAL-0.4]  89.06 125.57 0 top
R99  6.8K  [R0603]  99.58 128.52 0 top
R100  6.8K  [R0603]  168.43 137.49 0 top
R101  6.8K  [R0603]  122.58 163.73 0 top
R102  0Ω  [R1210]  13.84 104.4 0 top
R103  0Ω  [R1210]  13.89 109.66 0 top
R107  0Ω  [R1210]  12.62 77.95 0 top
R108  0Ω  [R1210]  12.62 85.55 0 top
R110  0Ω  [R1210]  12.62 53.4 0 top
R111  0Ω  [R1210]  12.62 61.45 0 top
R113  210pF@1kHz  [RES-TH_L12.5-W5.1-P7.50-D1.2-S2.20]  25.91 258.1 90 top
R114  10K  [R0603]  18.38 0 0 top
R115  10K  [R0603]  21.8 1.97 0 top
R116  10K  [R0603]  25.22 3.95 0 top
U5  DS1040-04RN  [KEY-TH_DS1040-04RN]  159.94 410.47 0 top
U17  LV25-P  [SENSOR-TH_LV25-P]  54.86 444.63 90 top
U21  TL074IDT  [SOIC-14_L8.7-W3.9-P1.27-LS6.0-BL]  134.56 426.09 0 top
U22  DS1040-04RN  [KEY-TH_DS1040-04RN]  217.53 442.43 0 top
U24  -  [TEL_8_SERIES]  313.31 339.73 0 top
U26  DS1040-04RN  [KEY-TH_DS1040-04RN]  157.4 362.56 0 top
U28  DS1040-04RN  [KEY-TH_DS1040-04RN]  214.99 389.45 0 top
U29  TL074IDT  [SOIC-14_L8.7-W3.9-P1.27-LS6.0-BL]  182.27 376.87 0 top
U30  DS1040-04RN  [KEY-TH_DS1040-04RN]  159.94 462.92 0 top
U32  DS1040-04RN  [KEY-TH_DS1040-04RN]  217.53 488.73 0 top
U33  TL074IDT  [SOIC-14_L8.7-W3.9-P1.27-LS6.0-BL]  184.81 478.5 0 top
U43  DS1040-04RN  [KEY-TH_DS1040-04RN]  346.96 386.34 270 top
U44  DS1040-04RN  [KEY-TH_DS1040-04RN]  348.91 367.76 270 top
U46  TL074IDT  [SOIC-14_L8.7-W3.9-P1.27-LS6.0-BL]  341.5 400.69 0 top
U47  YC0220500000G  [CONN-TH_YC0220500000G]  93.6 369.57 0 top
U48  YC0220500000G  [CONN-TH_YC0220500000G]  91.25 314.31 0 top
U49  DS1040-04RN  [KEY-TH_DS1040-04RN]  119.59 269.11 0 top
U50  DS1040-04RN  [KEY-TH_DS1040-04RN]  175.53 292.94 0 top
U51  YC0220500000G  [CONN-TH_YC0220500000G]  89.98 290.4 0 top
U52  YC0220500000G  [CONN-TH_YC0220500000G]  89.98 281.83 0 top
U53  TL074IDT  [SOIC-14_L8.7-W3.9-P1.27-LS6.0-BL]  101.83 280.56 0 top
U55  YC0220500000G  [CONN-TH_YC0220500000G]  0.25 452.63 270 top
U57  YC0220500000G  [CONN-TH_YC0220500000G]  6.48 258.7 270 top
U59  LM317D  [TO-252-2_L6.6-W6.1-P4.57-LS9.9-BR-CW]  146.3 214.95 0 top
U60  220uF  [CAP-TH_BD6.3-P2.50-D0.6-FD]  123.4 212.41 0 top
U61  220uF  [CAP-TH_BD6.3-P2.50-D0.6-FD]  123.4 204.26 0 top
U62  -  [KAM0724]  130.56 202.82 0 top
U63  220uF  [CAP-TH_BD6.3-P2.50-D0.6-FD]  36.83 184.94 0 top
U64  LV25-P  [SENSOR-TH_LV25-P]  55.12 375.41 90 top
U65  YC0220500000G  [CONN-TH_YC0220500000G]  0 425.2 270 top
U66  LV25-P  [SENSOR-TH_LV25-P]  54.86 410.08 90 top
U67  YC0220500000G  [CONN-TH_YC0220500000G]  0.25 439.04 270 top
U68  BAT54S  [SOT-23-3_L2.9-W1.3-P1.90-LS2.4-BR]  158.48 129.6 0 top
U69  BAT54S  [SOT-23-3_L2.9-W1.3-P1.90-LS2.4-BR]  164.81 146.67 0 top
U70  BAT54S  [SOT-23-3_L2.9-W1.3-P1.90-LS2.4-BR]  162.27 123.16 0 top
U71  BAT54S  [SOT-23-3_L2.9-W1.3-P1.90-LS2.4-BR]  175.89 157.99 0 top
U72  BAT54S  [SOT-23-3_L2.9-W1.3-P1.90-LS2.4-BR]  179.14 134.65 0 top
U73  AD7705BRZ  [SOIC-16_L10.3-W7.5-P1.27-LS10.3-BL]  28.58 90.93 0 top
U76  4.9152MHz  [CRYSTAL-SMD_L11.4-W4.7-LS12.7]  30.48 101.6 180 top
U77  AD7705BRZ  [SOIC-16_L10.3-W7.5-P1.27-LS10.3-BL]  28.45 70.23 0 top
U79  4.9152MHz  [CRYSTAL-SMD_L11.4-W4.7-LS12.7]  30.61 80.65 180 top
U80  AD7705BRZ  [SOIC-16_L10.3-W7.5-P1.27-LS10.3-BL]  30.1 45.47 0 top
U82  4.9152MHz  [CRYSTAL-SMD_L11.4-W4.7-LS12.7]  32.51 56.14 180 top
U87  G800W302018EU  [HDR-TH_6P-P2.54-V-M]  49.4 12.45 0 top
U88  PZ2.54-1*2  [HDR-TH_2P-P2.54-V-M-3]  61.72 12.45 0 top
U89  2.54-1*4  [HDR-TH_4P-P2.54-V-M-1]  34.92 12.45 0 top

## Footprints (pads in the part's own frame, mm; a bottom-side part is the same pattern mirrored in y, then rotated)
C0805
  rect 1.41x1.35 smd: 1(-1,0) 2(1,0)
CAP-SMD_L3.2-W1.6-FD
  rect 1.2x1.5 smd: 1(-1.2,0) 2(1.2,0)
CAP-TH_BD6.3-P2.50-D0.6-FD
  round 1.75 hole 1.1: 1(-1.25,0) 2(1.25,0)
CAP-TH_BD18.0-P7.50-D1.2-FD
  round 2.2 hole 1.2: 1(-3.75,0) 2(3.75,0)
CASE-A_3216
  rect 1.5x1.359 smd: 1(-1.2,0) 2(1.2,0)
CONN-TH_YC0220500000G
  round 2.2 hole 1.4: 1(-2.54,0) 2(2.54,0)
CRYSTAL-SMD_L11.4-W4.7-LS12.7
  rect 5.5x1.4 smd: 1(-4.5,0) 2(4.5,0)
FUSE-TH_L8.5-W4.0-P5.08-D0.6
  round 1.8 hole 1: 1(-2.54,0) 2(2.54,0)
HDR-TH_2P-P2.54-V-M-3
  rect 1.8x1.8 hole 1.1: 1(-1.27,0)
  round 1.8 hole 1.1: 2(1.27,0)
HDR-TH_4P-P2.54-V-M-1
  rect 1.7x1.7 hole 1.1: 1(-3.81,0)
  round 1.7 hole 1.1: 2(-1.27,0) 3(1.27,0) 4(3.81,0)
HDR-TH_6P-P2.54-V-M
  rect 1.7x1.7 hole 1.1: 1(-6.35,0)
  round 1.7 hole 1.1: 2(-3.81,0) 3(-1.27,0) 4(1.27,0) 5(3.81,0) 6(6.35,0)
KAM0724
  round 1.524 hole 1: 1(-95.631,57.188) 2(-95.631,39.688) 3(-95.631,22.188) 4(-48.631,29.688) 5(-48.631,49.688)
KEY-TH_DS1040-04RN
  round 1.6 hole 1: 1(-3.81,-3.81) 2(-1.27,-3.81) 3(1.27,-3.81) 4(3.81,-3.81) 5(3.81,3.81) 6(1.27,3.81) 7(-1.27,3.81) 8(-3.81,3.81)
L0805
  rect 1.133x1.377 smd: 1(-0.966,0) 2(0.966,0)
R0603
  rect 0.806x0.864 smd: 1(-0.753,0) 2(0.753,0)
R1210
  rect 1.282x2.808 smd: 1(-1.441,0) 2(1.441,0)
R_AXIAL-0.4
  round 1.879 hole 0.899: 1(-5.08,0) 2(5.08,0)
RES-TH_BD8.0-L24.5-P28.50-D0.8
  round 2.5 hole 1.2: 1(-14.5,0) 2(14.5,0)
RES-TH_L12.5-W5.1-P7.50-D1.2-S2.20
  round 2 hole 1.2: 1(-3.749,1.1) 2(3.749,-1.1)
SENSOR-TH_LV25-P
  round 1.8 hole 1.2: 1(-7.62,-10.16) 2(0,-10.16) 3(7.62,-10.16)
  round 1.5 hole 0.9: 4(7.62,10.16) 5(-7.62,10.16)
SOIC-14_L8.7-W3.9-P1.27-LS6.0-BL
  oval 0.574x2.038 smd: 1(-3.81,-2.769) 2(-2.54,-2.769) 3(-1.27,-2.769) 4(0,-2.769) 5(1.27,-2.769) 6(2.54,-2.769) 7(3.81,-2.769) 8(3.81,2.769) 9(2.54,2.769) 10(1.27,2.769) 11(0,2.769) 12(-1.27,2.769) 13(-2.54,2.769) 14(-3.81,2.769)
SOIC-16_L10.3-W7.5-P1.27-LS10.3-BL
  oval 0.574x2.401 smd: 1(-4.445,-4.75) 2(-3.175,-4.75) 3(-1.905,-4.75) 4(-0.635,-4.75) 5(0.635,-4.75) 6(1.905,-4.75) 7(3.175,-4.75) 8(4.445,-4.75) 9(4.445,4.75) 10(3.175,4.75) 11(1.905,4.75) 12(0.635,4.75) 13(-0.635,4.75) 14(-1.905,4.75) 15(-3.175,4.75) 16(-4.445,4.75)
SOT-23-3_L2.9-W1.3-P1.90-LS2.4-BR
  rect 1.25x0.7 smd: 1(1,-0.95) 2(1,0.95) 3(-1,0)
TEL_8_SERIES
  rect 2.54x2.54 hole 0.762: 1(0,-5.08) 16(0,5.08)
  round 1.27 hole 0.762: 7(15.24,-5.08)
  rect 1.27x2.54 hole 0.762: 8(17.78,-5.08) 9(17.78,5.08) 10(15.24,5.08)
TO-252-2_L6.6-W6.1-P4.57-LS9.9-BR-CW
  rect 3x1.6 smd: 1(3.424,-2.29) 3(3.424,2.29)
  rect 6.2x5.8 smd: 2(-3.424,0)

## Nets
3.3V: C53.1 C56.1 C59.1 R10.2 R23.2 R36.2 R74.2 R86.2 R92.2 U59.2 U63.1 U68.2 U69.2 U70.2 U71.2 U72.2 U73.9 U77.9 U80.9
+15V: U17.2 U21.11 U24.9 U29.11 U33.11 U46.11 U47.1 U51.1 U53.11 U60.1 U64.2 U66.2
-15V: U17.3 U21.4 U24.10 U29.4 U33.4 U46.4 U47.2 U51.2 U53.4 U61.2 U64.3 U66.3
GND: C1.2 C12.2 C17.2 C32.2 C37.2 C45.2 C46.2 C47.2 C48.2 C49.2 R3.2 R14.1 R27.1 R40.1 R78.1 R90.1 R91.1 R95.2 R98.2 U21.5 U24.8 U29.5 U33.5 U46.5 U48.2 U52.2 U53.5 U60.2 U61.1 U63.2 U68.1 U69.1 U70.1 U71.1 U72.1
$1N1565: R2.2 U17.4
$1N1815: R3.1 R93.1 U17.1
$1N1976: R4.1 U21.1 U21.2
$1N2054: R5.2 U5.1
$1N2080: R6.2 U5.2
$1N2106: R7.2 U5.3
$1N2182: R8.2 U5.4
$1N2231: R9.1 U5.5 U5.6 U5.7 U5.8 U21.7
$1N2551: R11.1 U21.8 U21.9
$1N2651: R9.2 R10.1 U21.10
$1N3069: C5.2 C7.2 C8.2 C9.2 R11.2 R12.1
$1N3119: C1.1 R12.2 U21.12
$1N3183: R13.1 R14.2 U21.13
$1N3559: R4.2 R5.1 R6.1 R7.1 R8.1 U21.6
$1N4470: C5.1 U22.4
$1N4476: R13.2 U21.14 U22.5 U22.6 U22.7 U22.8 U68.3 U77.6
$1N4558: C7.1 U22.2
$1N4584: C8.1 U22.1
$1N4643: C9.1 U22.3
$1N5599: F1.1 U57.1
$1N5603: R113.1 U57.2 U62.2
$1N6524: R17.2 R18.1 R19.1 R20.1 R21.1 U29.6
$1N6525: R18.2 U26.1
$1N6527: R22.1 U26.5 U26.6 U26.7 U26.8 U29.7
$1N6528: R20.2 U26.3
$1N6529: R19.2 U26.2
$1N6533: R21.2 U26.4
$1N6536: R17.1 U29.1 U29.2
$1N6537: R24.1 U29.8 U29.9
$1N6538: R22.2 R23.1 U29.10
$1N6541: R26.2 U28.5 U28.6 U28.7 U28.8 U29.14 U70.3 U80.7
$1N6548: R26.1 R27.2 U29.13
$1N6549: C13.1 U28.4
$1N6551: C16.1 U28.3
$1N6553: C13.2 C14.2 C15.2 C16.2 R24.2 R25.1
$1N6559: C12.1 R25.2 U29.12
$1N6560: C14.1 U28.2
$1N6568: C15.1 U28.1
$1N7416: R30.2 R31.1 R32.1 R33.1 R34.1 U33.6
$1N7417: R31.2 U30.1
$1N7419: R35.1 U30.5 U30.6 U30.7 U30.8 U33.7
$1N7420: R33.2 U30.3
$1N7421: R32.2 U30.2
$1N7425: R34.2 U30.4
$1N7428: R30.1 U33.1 U33.2
$1N7429: R37.1 U33.8 U33.9
$1N7430: R35.2 R36.1 U33.10
$1N7440: R39.1 R40.2 U33.13
$1N7441: C18.1 U32.4
$1N7443: C21.1 U32.3
$1N7445: C18.2 C19.2 C20.2 C21.2 R37.2 R38.1
$1N7451: C17.1 R38.2 U33.12
$1N7452: C19.1 U32.2
$1N7460: C20.1 U32.1
$1N10154: R72.2 U43.4
$1N10155: R68.2 R69.1 R70.1 R71.1 R72.1 U46.6
$1N10156: R73.1 U43.5 U43.6 U43.7 U43.8 U46.7
$1N10157: R71.2 U43.3
$1N10158: R70.2 U43.2
$1N10165: C36.1 U44.3
$1N10167: C33.2 C34.2 C35.2 C36.2 R75.2 R76.1
$1N10173: C35.1 U44.1
$1N10175: C34.1 U44.2
$1N10180: R69.2 U43.1
$1N10182: R68.1 U46.1 U46.2
$1N10186: R77.1 R78.2 U46.13
$1N10196: C33.1 U44.4
$1N10198: C32.1 R76.2 U46.12
$1N10199: R73.2 R74.1 U46.10
$1N10200: R75.1 U46.8 U46.9
$1N14932: U17.5 U55.1
$1N17336: F1.2 R113.2 U62.1
$1N20202: R80.1 U53.1 U53.2
$1N20203: R81.2 U49.1
$1N20204: R82.2 U49.2
$1N20205: R83.2 U49.3
$1N20206: R84.2 U49.4
$1N20207: R85.1 U49.5 U49.6 U49.7 U49.8 U53.7
$1N20208: R87.1 U53.8 U53.9
$1N20209: R85.2 R86.1 U53.10
$1N20211: C38.2 C39.2 C40.2 C41.2 R87.2 R88.1
$1N20212: C37.1 R88.2 U53.12
$1N20213: R89.1 R90.2 U53.13
$1N20216: R80.2 R81.1 R82.1 R83.1 R84.1 U53.6
$1N20218: C38.1 U50.4
$1N20221: C41.1 U50.3
$1N20222: C40.1 U50.1
$1N20223: C39.1 U50.2
$1N20370: R2.1 U55.2
$1N20734: R91.2 R92.1 U59.1
$1N23806: C44.2 U24.1 U62.4
$1N36258: L1.1 U62.5
$1N36284: C44.1 L1.2 U24.16 U59.3
$1N41392: C45.1 R93.2 U21.3
$1N41681: C46.1 R96.2 U33.3
$1N41683: R94.2 U64.4
$1N41685: R95.1 R96.1 U64.1
$1N41691: U64.5 U65.1
$1N41692: R94.1 U65.2
$1N42087: R98.1 R99.1 U66.1
$1N42093: R97.2 U66.4
$1N42096: R97.1 U67.2
$1N42097: U66.5 U67.1
$1N42100: C47.1 R99.2 U29.3
$1N42167: C48.1 R100.2 U53.3
$1N42170: R100.1 U52.1
$1N42233: C49.1 R101.2 U46.3
$1N42236: R101.1 U48.1
$1N42770: R89.2 U50.5 U50.6 U50.7 U50.8 U53.14 U72.3 U73.6
$1N42778: R77.2 U44.5 U44.6 U44.7 U44.8 U46.14 U71.3 U73.7
$1N48627: R102.2 U73.11
$1N48652: R103.2 U73.8
$1N49268: U73.1 U77.1 U80.1 U89.1
$1N49371: U73.12 U87.3
$1N49864: R39.2 U32.5 U32.6 U32.7 U32.8 U33.14 U69.3 U77.7
$1N50089: C55.2 U73.2 U76.1
$1N50097: C54.2 U73.3 U76.2
$1N50124: R116.2 U73.4 U87.2
$1N50498: U77.12 U87.6
$1N50514: R115.2 U77.4 U87.5
$1N50518: R107.2 U77.11
$1N50524: R108.2 U77.8
$1N50527: C57.2 U77.3 U79.2
$1N50531: C58.2 U77.2 U79.1
$1N50877: U80.12 U89.4
$1N50889: U80.13 U80.14 U89.2
$1N50893: R114.2 U80.4 U89.3
$1N50897: R110.2 U80.11
$1N50903: R111.2 U80.8
$1N50906: C60.2 U80.3 U82.2
$1N50910: C61.2 U80.2 U82.1
$1N54544: C62.1 C63.1 C64.1 C65.1 C66.1 C67.1 R114.1 R115.1 R116.1 U73.5 U73.15 U77.5 U77.15 U80.5 U80.15 U88.1
$1N54877: C53.2 C54.1 C55.1 C56.2 C57.1 C58.1 C59.2 C60.1 C61.1 C62.2 C63.2 C64.2 C65.2 C66.2 C67.2 R102.1 R103.1 R107.1 R108.1 R110.1 R111.1 U73.10 U73.16 U77.10 U77.16 U80.10 U80.16 U88.2
$1N61802: U77.13 U77.14 U87.4
$1N61814: U73.13 U73.14 U87.1

Pads without a net: U24 7; U62 3; U80 6
